# Altium schematic sheet atmega328P.SchDoc
size A4; SheetNumber: 2; SheetTotal: 3
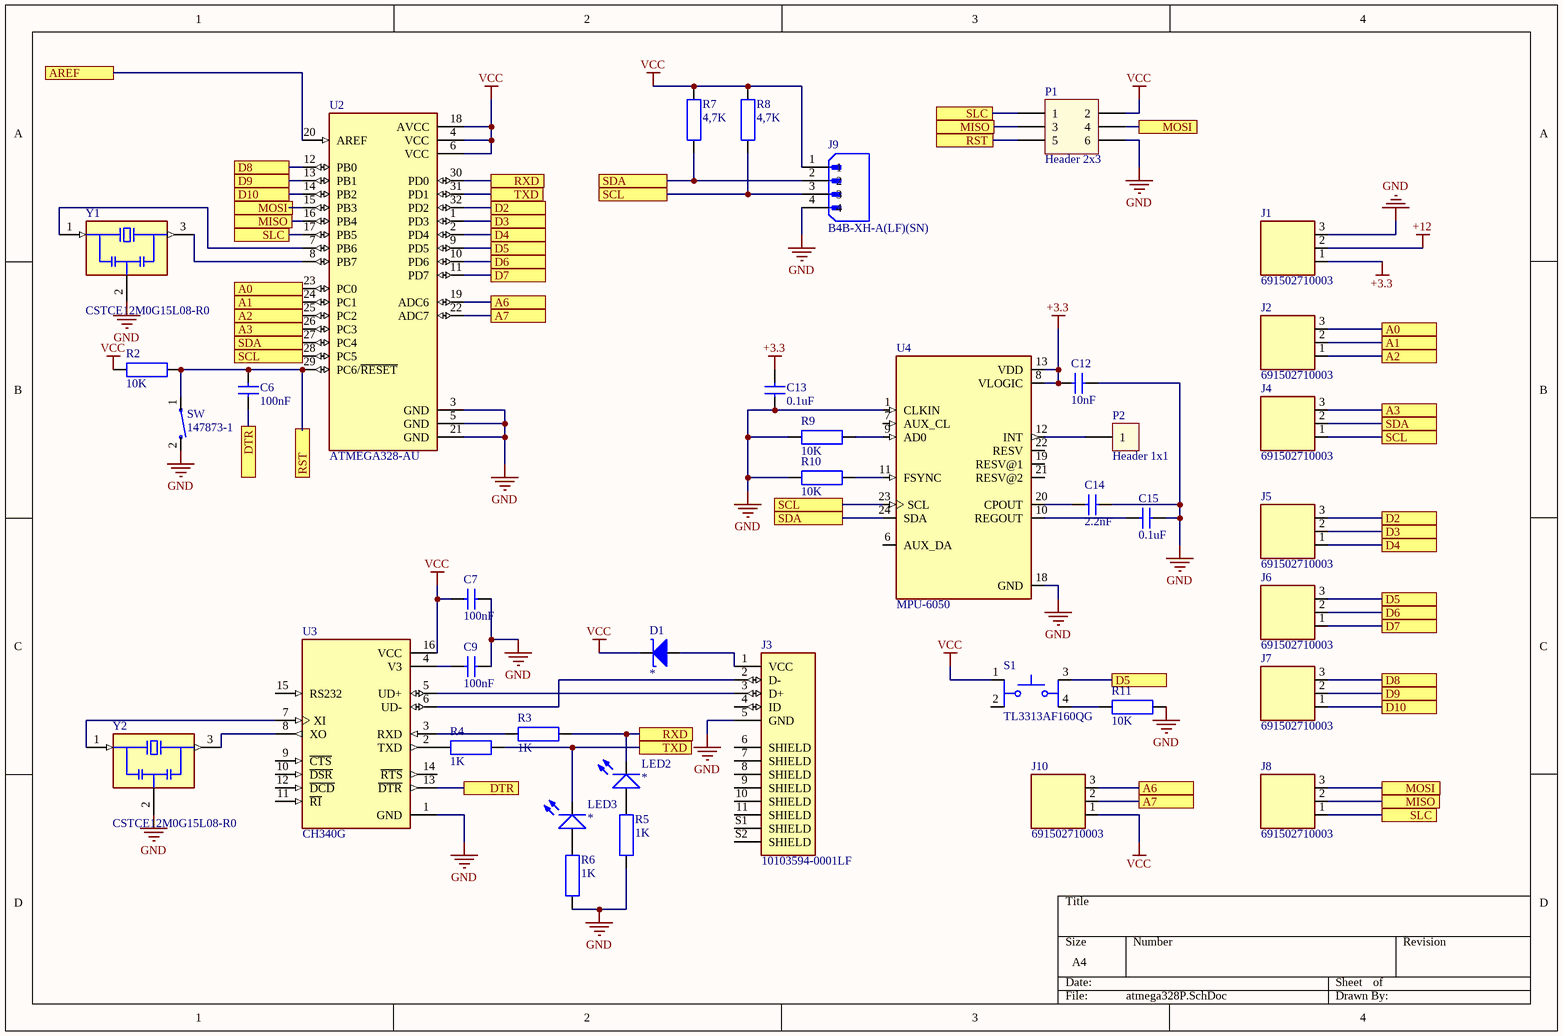
[diagram p0: atmega328P.SchDoc]

## Parts
C6  100nF  [SMD_CAPACITOR_0805]
C7  100nF  [SMD_CAPACITOR_0805]
C9  100nF  [SMD_CAPACITOR_0805]
C12  10nF  [SMD_CAPACITOR_0805]
C13  0.1uF  [SMD_CAPACITOR_0805]
C14  2.2nF  [SMD_CAPACITOR_0805]
C15  0.1uF  [SMD_CAPACITOR_0805]
D1  *  [SMD_DO-214AC]
J1  691502710003  [691502710003]
J2  691502710003  [691502710003]
J3  10103594-0001LF  [AMPHENOL_10103594-0001LF]
J4  691502710003  [691502710003]
J5  691502710003  [691502710003]
J6  691502710003  [691502710003]
J7  691502710003  [691502710003]
J8  691502710003  [691502710003]
J9  B4B-XH-A(LF)(SN)  [JST_B4B-XH-A(LF)(SN)]
J10  691502710003  [691502710003]
LED2  *  [SMD_LED_0805]
LED3  *  [SMD_LED_0805]
P1  Header 2x3  [THT_HEADER_100MIL_2X3_MALE]
P2  Header 1x1  [THT_HEADER_100MIL_1X1_MALE]
R2  10K  [SMD_RESISTOR_0805]
R3  1K  [SMD_RESISTOR_0805]
R4  1K  [SMD_RESISTOR_0805]
R5  1K  [SMD_RESISTOR_0805]
R6  1K  [SMD_RESISTOR_0805]
R7  4,7K  [SMD_RESISTOR_0805]
R8  4,7K  [SMD_RESISTOR_0805]
R9  10K  [SMD_RESISTOR_0805]
R10  10K  [SMD_RESISTOR_0805]
R11  10K  [SMD_RESISTOR_0805]
S1  TL3313AF160QG  [SW_TL3313AF160QG]
SW  147873-1  [SW_147873-1]
U2  ATMEGA328-AU  [QFP80P900X900X120-32N]
U3  CH340G  [SOIC127P600X180-16N]
U4  MPU-6050  [QFN50P400X400X95-24N]
Y1  CSTCE12M0G15L08-R0  [OSC_CSTCE12M0G15L08-R0]
Y2  CSTCE12M0G15L08-R0  [OSC_CSTCE12M0G15L08-R0]

## Ports
A0, A1, A2, A3, A6, A7, AREF, D2, D3, D4, D5, D6, D7, D8, D9, D10, DTR, MISO, MOSI, RST, RXD, SCL, SDA, SLC, TXD

## Nets
+3.3: C12.2 C13.2 J1.1 U4.8(VLOGIC) U4.13(VDD)
+12: J1.2
GND: C7.1 C9.1 C12.1 C13.1 C14.1 C15.1 J1.3 J3.5(GND) J9.4 P1.6 R5.2 R6.1 R9.1 R10.1 R11.2 SW.2 U2.3(GND) U2.5(GND) U2.21(GND) U3.1(GND) U4.1(CLKIN) U4.18(GND) Y1.2(GND) Y2.2(GND)
VCC: C7.2 D1.2 J9.1 J10.1 P1.2 R2.1 R7.1 R8.1 S1.1 U2.4(VCC) U2.6(VCC) U2.18(AVCC) U3.16(VCC)
A0: J2.3 U2.23(PC0) ; port A0
A1: J2.2 U2.24(PC1) ; port A1
A2: J2.1 U2.25(PC2) ; port A2
A3: J4.3 U2.26(PC3) ; port A3
A6: J10.3 U2.19(ADC6) ; port A6
A7: J10.2 U2.22(ADC7) ; port A7
AREF: U2.20(AREF) ; port AREF
D2: J5.3 U2.32(PD2) ; port D2
D3: J5.2 U2.1(PD3) ; port D3
D4: J5.1 U2.2(PD4) ; port D4
D5: J6.3 S1.3 U2.9(PD5) ; port D5
D6: J6.2 U2.10(PD6) ; port D6
D7: J6.1 U2.11(PD7) ; port D7
D8: J7.3 U2.12(PB0) ; port D8
D9: J7.2 U2.13(PB1) ; port D9
D10: J7.1 U2.14(PB2) ; port D10
DTR: C6.2 U3.13(~{DTR}) ; port DTR
MISO: J8.2 P1.3 U2.16(PB4) ; port MISO
MOSI: J8.3 P1.4 U2.15(PB3) ; port MOSI
RST: C6.1 P1.5 R2.2 SW.1 U2.29(PC6/~{RESET}) ; port RST
RXD: LED2.2 R3.2 U2.30(PD0) ; port RXD
SCL: J4.1 J9.3 R8.2 U2.28(PC5) U4.23(SCL) ; port SCL
SDA: J4.2 J9.2 R7.2 U2.27(PC4) U4.24(SDA) ; port SDA
SLC: J8.1 P1.1 U2.17(PB5) ; port SLC
TXD: LED3.2 R4.2 U2.31(PD1) ; port TXD
NetC9_2: C9.2 U3.4(V3)
NetC14_2: C14.2 U4.20(CPOUT)
NetC15_2: C15.2 U4.10(REGOUT)
NetD1_1: D1.1 J3.1(VCC)
NetJ3_2: J3.2(D-) U3.6(UD-)
NetJ3_3: J3.3(D+) U3.5(UD+)
NetLED2_1: LED2.1 R5.1
NetLED3_1: LED3.1 R6.2
NetP2_1: P2.1 U4.12(INT)
NetR3_1: R3.1 U3.3(RXD)
NetR4_1: R4.1 U3.2(TXD)
NetR9_2: R9.2 U4.9(AD0)
NetR10_2: R10.2 U4.11(FSYNC)
NetR11_1: R11.1 S1.4
NetU2_7: U2.7(PB6) Y1.1(IN)
NetU2_8: U2.8(PB7) Y1.3(OUT)
NetU3_7: U3.7(XI) Y2.1(IN)
NetU3_8: U3.8(XO) Y2.3(OUT)

Not connected (* = marked no-connect by the designer): J3 4(ID) 6(SHIELD) 7(SHIELD) 8(SHIELD) 9(SHIELD) 10(SHIELD) 11(SHIELD) S1(SHIELD) S2(SHIELD); S1 2; U3 9(~{CTS}) 10(~{DSR}) 11(~{RI}) 12(~{DCD}) 14(~{RTS}) 15(RS232); U4 6(AUX_DA) 7(AUX_CL) 19(RESV@1) 21(RESV@2) 22(RESV)

## Library data of the parts
C6 C7 C9 C12-C15 = Capacitor: 0805: http://cz.farnell.com/webapp/wcs/stores/servlet/Search?catalogId=15001&langId=420&storeId=10156&categoryId=700000005423&sort=P_PRICE&pageSize=100&beginIndex=1&showResults=true&sf=502,707&pf=1010141074,1012080068,1012245578; 1206: http://cz.farnell.com/webapp/wcs/stores/servlet/Search?catalogId=15001&langId=420&storeId=10156&categoryId=700000005423&sort=P_PRICE&pageSize=100&beginIndex=1&showResults=true&sf=502,707&pf=1012245584
  C6 C7 C9: Value: 100nF
  C12: Value: 10nF
  C13 C15: Value: 0.1uF
  C14: Value: 2.2nF
D1 = Diode_Schottky: Diode Schottky; DO-214AC: http://cz.farnell.com/webapp/wcs/stores/servlet/Search?catalogId=15001&langId=420&storeId=10156&categoryId=700000043508&sort=P_PRICE&pageSize=100&showResults=true&sf=502,707&pf=1010199473; SOD-123: http://cz.farnell.com/webapp/wcs/stores/servlet/Search?catalogId=15001&langId=420&storeId=10156&categoryId=700000043508&sort=P_PRICE&pageSize=100&showResults=true&sf=502,707&pf=1010130987; Value: *
J1 J2 J4-J8 J10 = 691502710003: 3 Position Wire to Board Terminal Block Horizontal with Board 0.197 (5.00mm) Through Hole; MF: Wurth Elektronik; Package: None; Price: None; Value: *; SnapEDA_Link: https://www.snapeda.com/parts/691502710003/Wurth+Elektronik/view-part/?ref=snap; MP: 691502710003; Availability: In Stock; Check_prices: https://www.snapeda.com/parts/691502710003/Wurth+Elektronik/view-part/?ref=eda
J3 = 10103594-0001LF: USB - micro B USB 2.0 Receptacle Connector 5 Position Surface Mount, Right Angle; Through Hole; Value: *; MP: 10103594-0001LF; Package: None; Availability: Unavailable; Price: None
J9 = B4B-XH-A(LF)(SN): Connector Header Through Hole 4 position 0.098 (2.50mm); MF: JST Sales; SnapEDA_Link: https://www.snapeda.com/parts/B4B-XH-A(LF)(SN)/JST+Sales+America+Inc./view-part/?ref=snap; Package: None; MP: B4B-XH-A(LF)(SN); Check_prices: https://www.snapeda.com/parts/B4B-XH-A(LF)(SN)/JST+Sales+America+Inc./view-part/?ref=eda; Purchase-URL: https://pricing.snapeda.com/search/part/B4B-XH-A(LF)(SN)/?ref=eda; Price: None; Value: *; Availability: In Stock
LED2 LED3 = LED: SUPER_BRIGHT: http://cz.farnell.com/kingbright/ka-3535sylz4s/led-hb-yellow-525mw-12lm/dp/2373359+; 0805: http://cz.farnell.com/webapp/wcs/stores/servlet/Search?catalogId=15001&langId=420&storeId=10156&categoryId=700000006139&sort=P_PRICE&pageSize=100&showResults=true&sf=502,707&pf=1010144644,1010253269; 1206: http://cz.farnell.com/webapp/wcs/stores/servlet/Search?catalogId=15001&langId=420&storeId=10156&categoryId=700000006139&sort=P_PRICE&pageSize=100&showResults=true&sf=502,707&pf=1010144644,1010305184; 5MM: http://cz.farnell.com/webapp/wcs/stores/servlet/Search?catalogId=15001&langId=420&storeId=10156&categoryId=700000006139&sort=P_PRICE&pageSize=100&showResults=true&sf=502,707&pf=1010195550,1012220634; 3MM: http://cz.farnell.com/webapp/wcs/stores/servlet/Search?catalogId=15001&langId=420&storeId=10156&categoryId=700000006139&sort=P_PRICE&pageSize=100&showResults=true&sf=502,707&pf=1010173716,1012220634; Value: *
P1 = Header_2x3
P2 = Header_1x1
R2-R11 = Resistor: 1206: http://cz.farnell.com/webapp/wcs/stores/servlet/Search?catalogId=15001&langId=420&storeId=10156&categoryId=700000005450&pageSize=100&showResults=true&sf=502,707&pf=1012211755; 0805: http://cz.farnell.com/webapp/wcs/stores/servlet/Search?catalogId=15001&langId=420&storeId=10156&categoryId=700000005450&sort=P_PRICE&pageSize=100&showResults=true&sf=502,707&pf=1012211743
  R2 R9-R11: Value: 10K
  R3-R6: Value: 1K
  R7 R8: Value: 4,7K
SW = 147873-1: Switch Tactile OFF (ON) SPST Rectangular Button J-Bend 0.05A 24VDC 1.77N SMD T/R; MF: TE Connectivity; SnapEDA_Link: https://www.snapeda.com/parts/147873-1/TE%20Connectivity%20ALCOSWITCH%20Switches/view-part/2549694/?ref=snap; Availability: Unavailable; Value: *; Price: None; MP: 147873-1; Package: None
U2 = ATMEGA328-AU: AVR AVRÂ® ATmega Microcontroller IC 8-Bit 20MHz 32KB (16K x 16) FLASH 32-TQFP (7x7); MF: Microchip; Check_prices: https://www.snapeda.com/parts/ATMEGA328-AU/Microchip/view-part/?ref=eda; Value: *; Availability: In Stock; MP: ATMEGA328-AU; Price: None; Package: TQFP-32 Microchip; SnapEDA_Link: https://www.snapeda.com/parts/ATMEGA328-AU/Microchip/view-part/?ref=snap; Purchase-URL: https://pricing.snapeda.com/search/part/ATMEGA328-AU/?ref=eda
U3 = CH340G: USB Interface Integrated Circuit; MF: WCH; Value: *; SnapEDA_Link: https://www.snapeda.com/parts/Ch340G/WCH/view-part/?ref=snap; MP: Ch340G; Check_prices: https://www.snapeda.com/parts/Ch340G/WCH/view-part/?ref=eda; Availability: Not in stock; Price: None; Package: None
U4 = MPU-6050: MPU-6050 series Accelerometer, Gyroscope, 3 Axis Sensor Evaluation Board; MF: TDK InvenSense; Value: *; SnapEDA_Link: https://www.snapeda.com/parts/MPU-6050/TDK+InvenSense/view-part/?ref=snap; Purchase-URL: https://pricing.snapeda.com/search/part/MPU-6050/?ref=eda; Availability: In Stock; Price: None; Package: QFN-24 InvenSense; Check_prices: https://www.snapeda.com/parts/MPU-6050/TDK+InvenSense/view-part/?ref=eda; MP: MPU-6050
Y1 Y2 = CSTCE12M0G15L08-R0: CSTCE Series 12 MHz 3.2 x 1.3 x 0.7 mm Built-in Capacitor SMT Resonator; MF: Murata; Package: SMD-3 Murata; Availability: Not in stock; Value: *; MP: CSTCE12M0G15L08-R0; Price: None; SnapEDA_Link: https://www.snapeda.com/parts/CSTCE12M0G15L08-R0/Murata/view-part/607914/?ref=snap; Check_prices: https://www.snapeda.com/parts/CSTCE12M0G15L08-R0/Murata/view-part/607914/?ref=eda
S1 = TL3313AF160QG: Price: None; MP: TL3313AF160QG; Availability: Unavailable; Package: None; Value: *